# EAGLE design powersensor (EAGLE 7.5.0)
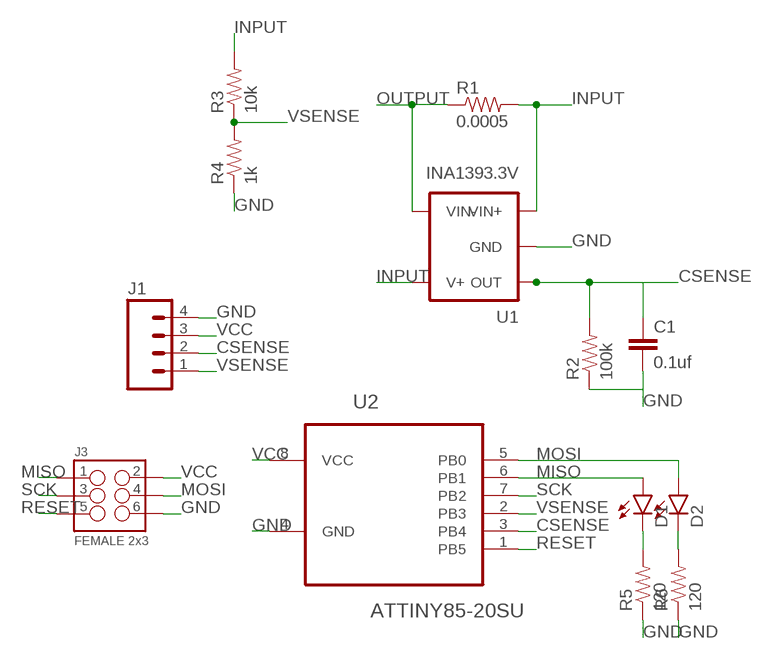
[diagram p0: schematic, sheet 1]

## Parts
C1  0.1uf  CAP0603-CAP  [0603-CAP]
D1  LED0603  [LED-0603]
D2  LED0603  [LED-0603]
J1  M04PTH  [1X04]
J3  FEMALE 2x3  M03X2FEMALE  [2X3]
R1  0.0005  RESISTOR2512  [R2512]
R2  100k  RESISTOR0603-RES  [0603-RES]
R3  10k  RESISTOR0603-RES  [0603-RES]
R4  1k  RESISTOR0603-RES  [0603-RES]
R5  120  RESISTOR0603-RES  [0603-RES]
R6  120  RESISTOR0603-RES  [0603-RES]
U1  INA1393.3V  [SOT23-5]
U2  ATTINY85-20SU  [SOIC127P798X216-8N]

## Nets
CSENSE: C1.1 J1.2 R2.2 U1.1(OUT) U2.3(PB4)
GND: C1.2 J1.4 J3.6 R2.1 R4.1 R5.1 R6.1 U1.2(GND) U2.4(GND)
INPUT: R1.2 R3.2 U1.3(VIN+) U1.5(V+)
MISO: D1.A J3.1 U2.6(PB1)
MOSI: D2.A J3.4 U2.5(PB0)
N$3: D1.C R5.2
N$4: D2.C R6.2
OUTPUT: R1.1 U1.4(VIN-)
RESET: J3.5 U2.1(PB5)
SCK: J3.3 U2.7(PB2)
VCC: J1.3 J3.2 U2.8(VCC)
VSENSE: J1.1 R3.1 R4.2 U2.2(PB3)

## Library data of the parts
C1 = SparkFun-Passives:CAP: Capacitor Standard 0603 ceramic capacitor, and 0.1" leaded capacitor.
D1 D2 = SparkFun-LED:LED: LEDs Standard schematic elements and footprints for 5mm, 3mm, 1206, and 0603 sized LEDs. 5mm - Spark Fun Electronics SKU : COM-00529 (and others)
J1 = SparkFun-Connectors:M04: Header 4 Standard 4-pin 0.1" header. Use with straight break away headers (SKU : PRT-00116), right angle break away headers (PRT-00553), swiss pins (PRT-00743), machine pins (PRT-00117), and female headers (PRT-00115). Molex polarized connector foot print use with SKU : PRT-08231 with associated crimp pins and housings. 1MM SMD Version SKU: PRT-10208; PROD_ID: CONN-09696
J3 = SparkFun-Connectors:M03X2: 2x3 .1" header. Shrouded, with keying- CONN-10681 SMT- CONN-11415 Pogo pins- HW-11044; PROD_ID: CONN-11566
R1-R6 = SparkFun-Resistors:RESISTOR: Resistor Basic schematic elements and footprints for 0603, 1206, and PTH resistors.
U1 = ina139:INA139: V_REG MIC5205 Standard 3.3V, 5V, and Adjustable 150mA LDO voltage regulator in SOT-23 layout. Micrel part MIC5205. BP (by-pass) pin is used to lower output noise with 470pF cap, may be left open. On the adjustable version BP is used to set output.
U2 = Atmel_By_element14_Batch_1-00:ATTINY85-20SU: 8-bit Microcontroller with In-System Programmable Flash; MPN: ATTINY85-20SU; OC_FARNELL: 1455164; OC_NEWARK: 58M3797; PACKAGE: SOIC-8; SUPPLIER: Atmel

## Board
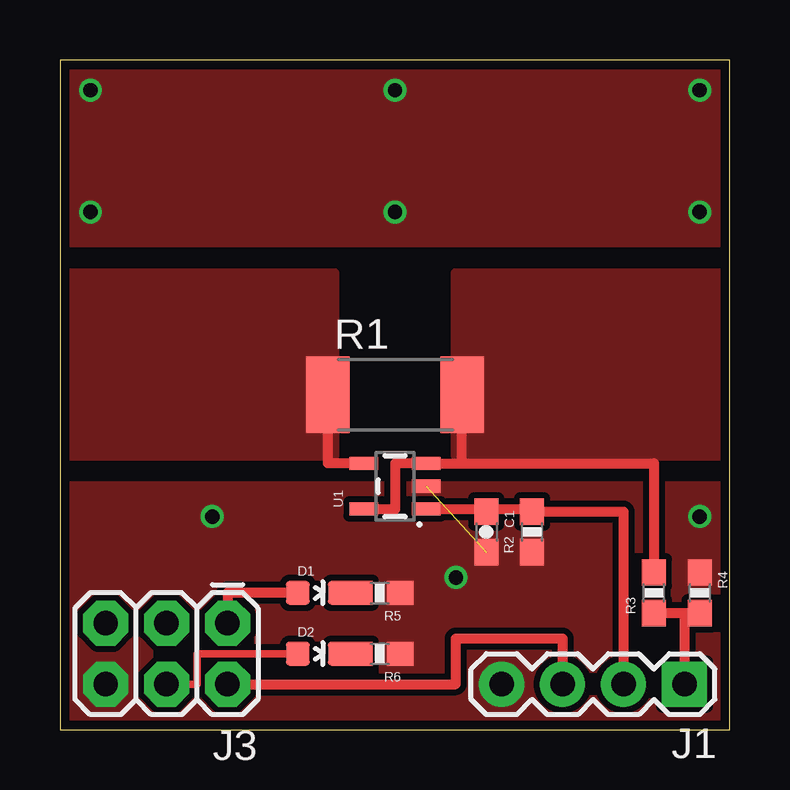
[diagram p1: board, top side]
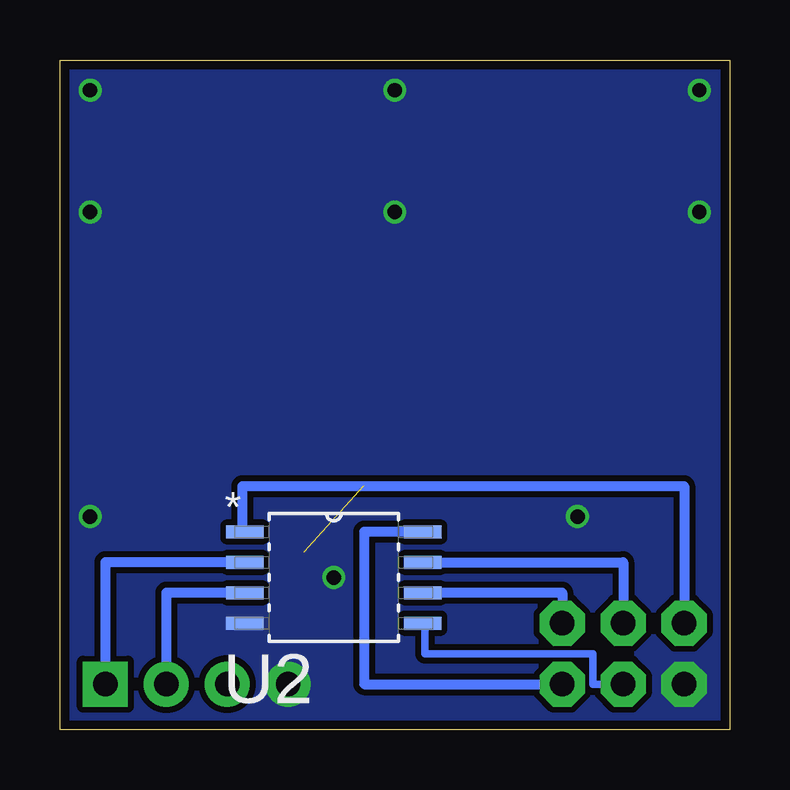
[diagram p2: board, bottom side, seen from below]

Size 27.93 x 27.93 mm. Coordinates in mm from the lower left corner, seen from the top.
Outline: 0,0 27.93,0 27.93,27.93 0,27.93 0,0
Copper layers (1*16): Top 0.0356mm / dielectric 1.5011mm / Bottom 0.0356mm
Design rules "LaenPCBOrder *": minimum track width 6mil, minimum drill 13mil, track to track 6mil, track to pad 6mil, pad to pad 6mil, via to via 6mil, smd to smd 6mil, copper to edge 15mil, drill to drill 6mil, minimum pad ring 7mil, minimum via ring 7mil, stop-mask expansion 3mil, vias tented up to drill 0mil, thermal gap 19mil

### Footprints (pad centres in the part's own frame; a part is rotated, then mirrored left to right if it is on the bottom)
0603-CAP = smd 1.1 x 1: 1 -0.85,0; 2 0.85,0
LED-0603 = smd 1 x 1: A 0,-0.877; C 0,0.877
1X04 = drill 1.016 pad 1.88 square: 1 0,0 | drill 1.016 pad 1.88: 2 2.54,0; 3 5.08,0; 4 7.62,0
2X3 = drill 1.016 pad 1.88 octagon: 1 0,0; 2 0,2.54; 3 2.54,0; 4 2.54,2.54; 5 5.08,0; 6 5.08,2.54
R2512 = smd 1.8 x 3.2: 1 -2.8,0; 2 2.8,0
0603-RES = smd 1.1 x 1: 1 -0.85,0; 2 0.85,0
SOT23-5 = smd 0.55 x 1.2: 1 -0.95,-1.3; 2 0,-1.3; 3 0.95,-1.3; 4 0.95,1.3; 5 -0.95,1.3
SOIC127P798X216-8N = smd 1.549 x 0.533: 1 -3.708,1.905; 2 -3.708,0.635; 3 -3.708,-0.635; 4 -3.708,-1.905; 5 3.708,-1.905; 6 3.708,-0.635; 7 3.708,0.635; 8 3.708,1.905

### Placement (x,y rotation side)
C1  17.78,8.26 270 top
D1  10.79,5.71 270 top
D2  10.79,3.17 270 top
J1  26.04,1.91 180 top
J3  6.99,4.45 180 top
R1  13.97,13.97 0 top
R2  19.68,8.26 90 top
R3  24.77,5.71 90 top
R4  26.67,5.71 270 top
R5  13.34,5.71 180 top
R6  13.34,3.17 180 top
U1  13.97,10.16 90 top
U2  16.51,6.35 0 bottom

### Tracks (layer width: path | path; a pad name or v marks a point on that pad's centre or on a via)
CSENSE
  Top 0.406: C1.1 17.78,9.21 U1.1 19.68,9.21 R2.2 23.5,9.11 J1.2
  Bottom 0.406: U2.3 23.5,5.71 J1.2
GND  (via drill 0.6)  (1 unrouted)
  other vias: 1.27,26.67 13.97,26.67 26.67,26.67 1.27,21.59 13.97,21.59 26.67,21.59 6.35,8.89 16.51,6.35 26.67,8.89
  pour Bottom (isolate 0.254, no thermals): 0,0 0,27.94 27.94,27.94 27.94,0
  pour Top: 0,27.94 27.94,27.94 27.94,20.32 0,20.32
  pour Top (isolate 0.254, no thermals): 0,10.16 27.94,10.16 27.94,0 0,0
INPUT
  Top 0.406: 16.77,11.11 U1.3 13.97,11.11 13.97,9.21 U1.5 | 16.77,11.11 R1.2 | 16.77,11.11 24.77,11.11 R3.2
  pour Top (no thermals): 16.51,19.05 27.94,19.05 27.94,11.43 16.51,11.43
MISO
  Top 0.406: D1.A 6.99,5.71 J3.1
  Bottom 0.406: J3.1 6.99,5.71 U2.6
MOSI
  Top 0.305: J3.4 5.71,1.91 5.71,3.17 D2.A
  Bottom 0.305: U2.5 12.7,4.45 12.7,3.17 5.71,3.17 5.71,1.91 J3.4
N$3
  Top 0.406: D1.C R5.2
N$4
  Top 0.406: D2.C R6.2
OUTPUT
  Top 0.406: U1.4 11.17,11.11 R1.1
  pour Top (no thermals): 0,19.05 11.43,19.05 11.43,11.43 0,11.43
RESET
  Bottom 0.406: U2.1 20.32,8.26 20.32,10.16 1.91,10.16 J3.5
SCK
  Bottom 0.406: U2.7 4.45,6.99 J3.3
VCC
  Top 0.406: J3.2 16.51,1.91 16.51,3.81 20.95,3.81 J1.3
  Bottom 0.406: U2.8 15.24,8.26 15.24,1.91 J3.2
VSENSE
  Top 0.406: R3.1 R4.2 26.04,4.87 J1.1
  Bottom 0.406: U2.2 26.04,6.99 J1.1